# Altium schematic sheet PowerSupply.SchDoc: TE0888 - PowerSupply
size A4; PageSetup: Record=PageOptions|CenterHorizontal=True|CenterVertical=True|PrintScale=0.96|XCorrection=1.00|YCorrection=1.00|PrintKind=0|BorderSize=5000000|LeftOffset=0|BottomOffset=0|Orientation=2|PaperLength=1000|PaperWidth=1000|Scale=100|PaperSource=7|PrintQuality=-4|MediaType=1|DitherType=10|PaperKind=A4|PrintScaleMode=1; Organization: Trenz Electronic GmbH; DocumentNumber: TE0888; Revision: 01; SheetNumber: 5; SheetTotal: 5; Date: 20.05.2015; CompanyName: Trenz Electronic GmbH; ProjectName: TE0888
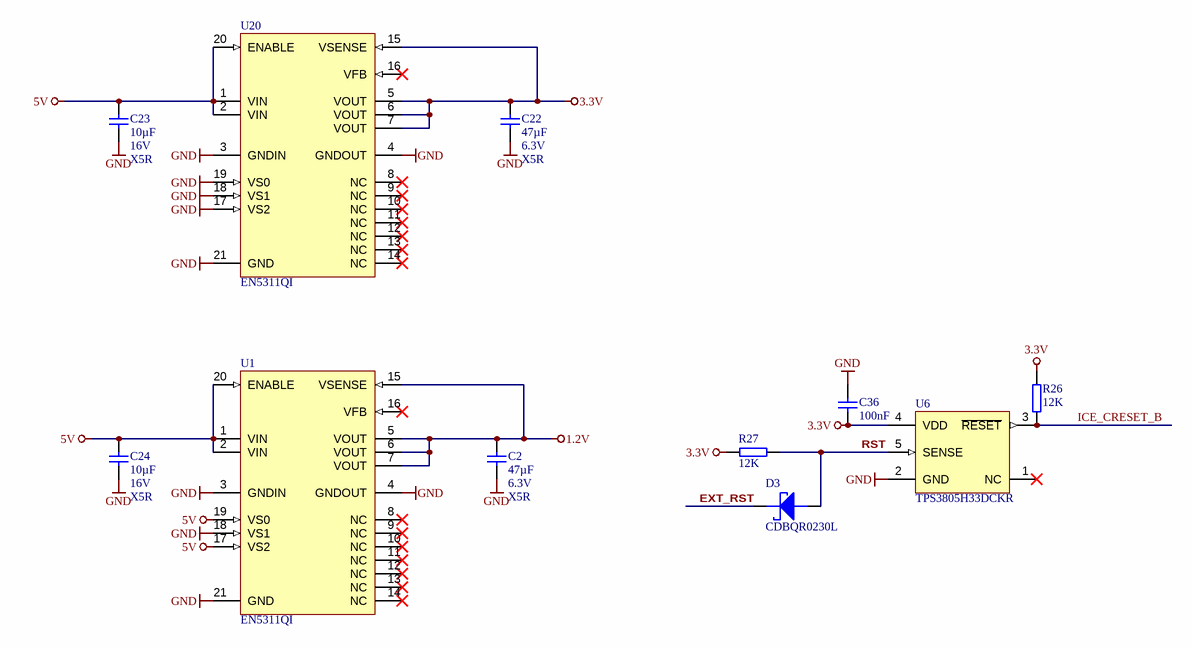
[diagram p0: PowerSupply.SchDoc]

## Parts
C2  47µF  Voltage: 6.3V  Technology: X5R  [CAPC2012X135N]
C22  47µF  Voltage: 6.3V  Technology: X5R  [CAPC2012X135N]
C23  10µF  Voltage: 16V  Technology: X5R  [CAPC1608X90N]
C24  10µF  Voltage: 16V  Technology: X5R  [CAPC1608X90N]
C36  100nF  [CAPC1005X55N]
D3  CDBQR0230L  [DIOC1006X55N]
R26  12K  [RESC1005X40N]
R27  12K  [RESC1005X40N]
U1  EN5311QI  [EN5311QI]
U6  TPS3805H33DCKR  [SOT65P210X110-5N]
U20  EN5311QI  [EN5311QI]

## Nets
1.2V: C2.2 U1.5(VOUT) U1.6(VOUT) U1.7(VOUT) U1.15(VSENSE)
3.3V: C22.2 C36.2 R26.2 R27.2 U6.4(VDD) U20.5(VOUT) U20.6(VOUT) U20.7(VOUT) U20.15(VSENSE)
5V: C23.1 C24.1 U1.1(VIN) U1.2(VIN) U1.17(VS2) U1.19(VS0) U1.20(ENABLE) U20.1(VIN) U20.2(VIN) U20.20(ENABLE)
GND: C2.1 C22.1 C23.2 C24.2 C36.1 U1.3(GNDIN) U1.4(GNDOUT) U1.18(VS1) U1.21(GND) U6.2(GND) U20.3(GNDIN) U20.4(GNDOUT) U20.17(VS2) U20.18(VS1) U20.19(VS0) U20.21(GND)
EXT_RST: D3.1(KATHODE)
ICE_CRESET_B: R26.1 U6.3(~{RESET})
RST: D3.2(ANODE) R27.1 U6.5(SENSE)

Not connected (* = marked no-connect by the designer): U1 8(NC)* 9(NC)* 10(NC)* 11(NC)* 12(NC)* 13(NC)* 14(NC)* 16(VFB)*; U6 1(NC)*; U20 8(NC)* 9(NC)* 10(NC)* 11(NC)* 12(NC)* 13(NC)* 14(NC)* 16(VFB)*

## Notes on the sheet
- Title:
- Number:
- Rev.
- Date:
- A4
- Copyright:
- Page
- of
- Filename:

## Library data of the parts
C2 C22 = 24718: KON 47µF 6,3V  X5R SMD 20%; AN: 24718; Mixed: SMT; Value: 47u; Preferred: Yes; Case: 2012 (0805); Tolerance: 20%
C23 C24 = 25341: KON 10µF 16V X5R SMD 20%; AN: 25341; Mixed: SMT; Value: 10u; Preferred: Yes; Case: 1608 (0603); Tolerance: 20%
C36 = 26183: KON 100nF 50V SMD AEC-Q200; AN: 26183; Tolerance: 10%; Mixed: SMT; Value: 100n; Case: 1005 (0402); Voltage: 50V; Technology: X7R
D3 = 26726: AN: 26726; Mixed: SMT; Voltage: 0.2A; Value: 30V; Case: SOD-923F (0402); HelpURL: B:\ad\adlib\datasheet\CDBQR0230L
R26 R27 = 22598: WID SMD 12K 1% 0,063W; AN: 22598; Mixed: SMT; Preferred: Yes; Case: 1005 (0402); Value: 12K
U1 U20 = 25492: AN: 25492; Mixed: SMT; Trenz-Stock: Yes; Case: QFN20; HelpURL: B:\AD\adlib\datasheet\EN5311QI; Preferred: Yes
U6 = 25049: AN: 25049; Mixed: SMT; Trenz-Stock: Yes; Case: SC70-5 / SC88A / SOT353; HelpURL: B:\AD\adlib\datasheet\TPS3805H33; Preferred: Yes